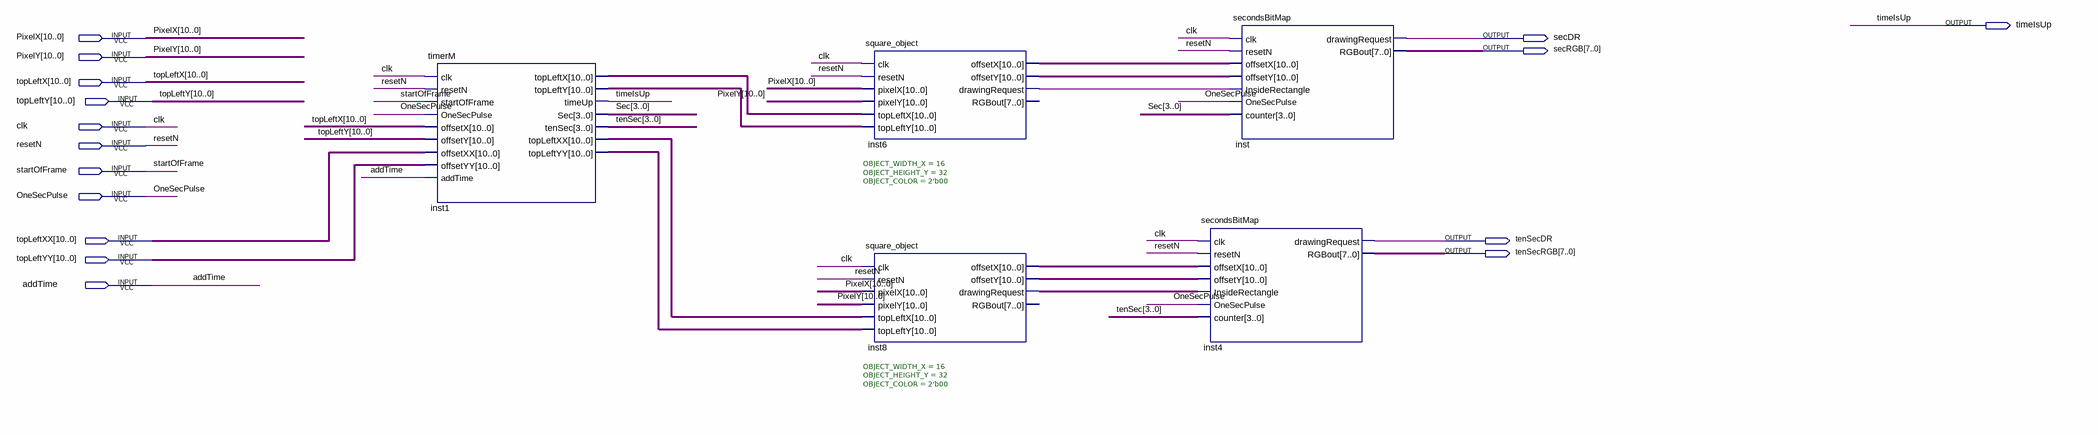
[diagram p0: schematic sheet]
// Quartus schematic timer.bdf as structural Verilog: 5 symbols, 16 pins
module timer (
  input  [10:0] PixelX,
  input  [10:0] PixelY,
  input  [10:0] topLeftX,
  input  [10:0] topLeftY,
  input  clk,
  input  resetN,
  input  startOfFrame,
  input  OneSecPulse,
  input  [10:0] topLeftXX,
  input  [10:0] topLeftYY,
  input  addTime,
  output timeIsUp,
  output secDR,
  output [7:0] secRGB,
  output tenSecDR,
  output [7:0] tenSecRGB
);

  wire inst6_drawingrequest, inst8_drawingrequest;
  wire [3:0] Sec, tenSec;
  wire [10:0] inst1_topleftx, inst1_topleftxx, inst1_toplefty, inst1_topleftyy, inst6_offsetx, inst6_offsety,
       inst8_offsetx, inst8_offsety;

  timerM inst1 (
    .clk(clk), .resetN(resetN), .startOfFrame(startOfFrame), .OneSecPulse(OneSecPulse), .offsetX(topLeftX),
    .offsetY(topLeftY), .offsetXX(topLeftXX), .offsetYY(topLeftYY), .addTime(addTime),
    .topLeftX(inst1_topleftx), .topLeftY(inst1_toplefty), .timeUp(timeIsUp), .Sec(Sec), .tenSec(tenSec),
    .topLeftXX(inst1_topleftxx), .topLeftYY(inst1_topleftyy));
  square_object #(.OBJECT_WIDTH_X(16), .OBJECT_HEIGHT_Y(32), .OBJECT_COLOR(2'b00)) inst6 (
    .clk(clk), .resetN(resetN), .pixelX(PixelX), .pixelY(PixelY), .topLeftX(inst1_topleftx),
    .topLeftY(inst1_toplefty), .offsetX(inst6_offsetx), .offsetY(inst6_offsety),
    .drawingRequest(inst6_drawingrequest));  // open: RGBout
  square_object #(.OBJECT_WIDTH_X(16), .OBJECT_HEIGHT_Y(32), .OBJECT_COLOR(2'b00)) inst8 (
    .clk(clk), .resetN(resetN), .pixelX(PixelX), .pixelY(PixelY), .topLeftX(inst1_topleftxx),
    .topLeftY(inst1_topleftyy), .offsetX(inst8_offsetx), .offsetY(inst8_offsety),
    .drawingRequest(inst8_drawingrequest));  // open: RGBout
  secondsBitMap inst4 (
    .clk(clk), .resetN(resetN), .offsetX(inst8_offsetx), .offsetY(inst8_offsety),
    .InsideRectangle(inst8_drawingrequest), .OneSecPulse(OneSecPulse), .counter(tenSec),
    .drawingRequest(tenSecDR), .RGBout(tenSecRGB));
  secondsBitMap inst (
    .clk(clk), .resetN(resetN), .offsetX(inst6_offsetx), .offsetY(inst6_offsety),
    .InsideRectangle(inst6_drawingrequest), .OneSecPulse(OneSecPulse), .counter(Sec), .drawingRequest(secDR),
    .RGBout(secRGB));
endmodule
